# EAGLE design Monophase (EAGLE 9.4.2)
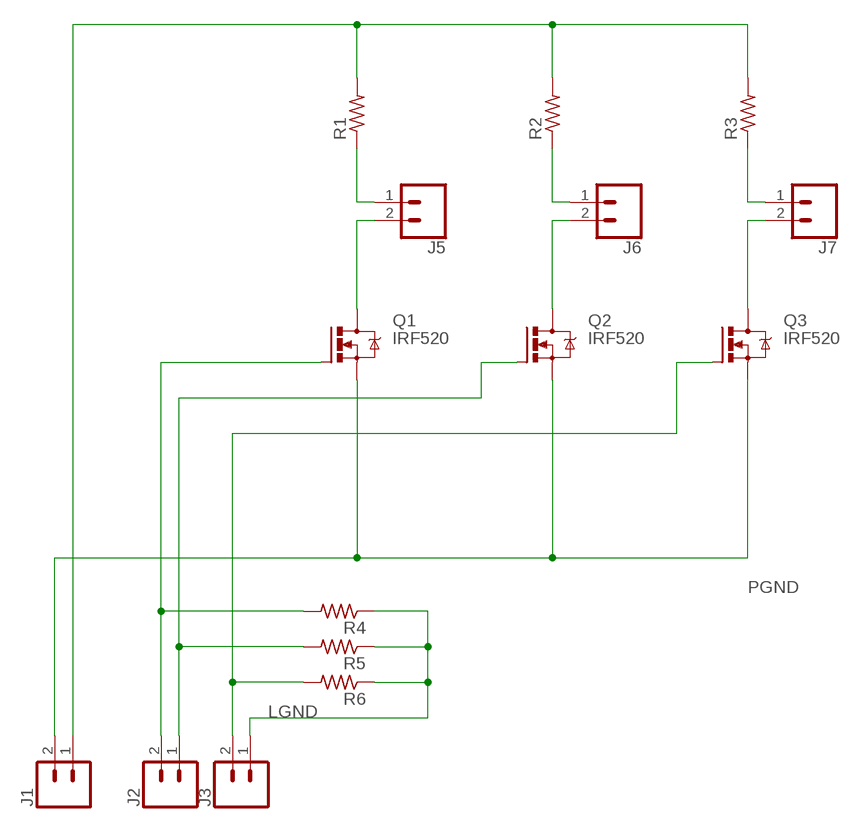
[diagram p0: schematic, sheet 1]

## Parts
J1  CONN_02POLAR_LOCK  [MOLEX-1X2_LOCK]
J2  CONN_02POLAR_LOCK  [MOLEX-1X2_LOCK]
J3  CONN_02POLAR_LOCK  [MOLEX-1X2_LOCK]
J5  CONN_02POLAR_LOCK  [MOLEX-1X2_LOCK]
J6  CONN_02POLAR_LOCK  [MOLEX-1X2_LOCK]
J7  CONN_02POLAR_LOCK  [MOLEX-1X2_LOCK]
Q1  IRF520  [TO220BV]
Q2  IRF520  [TO220BV]
Q3  IRF520  [TO220BV]
R1  R-US_0204/7  [0204/7]
R2  R-US_0204/7  [0204/7]
R3  R-US_0204/7  [0204/7]
R4  R-US_0204/7  [0204/7]
R5  R-US_0204/7  [0204/7]
R6  R-US_0204/7  [0204/7]

## Nets
LGND: J3.1 R4.1 R5.1 R6.1
N$1: J5.2 Q1.D
N$2: J6.2 Q2.D
N$3: J7.2 Q3.D
N$5: J5.1 R1.1
N$6: J6.1 R2.1
N$7: J7.1 R3.1
N$8: J1.1 R1.2 R2.2 R3.2
N$9: J2.2 Q1.G R4.2
N$10: J2.1 Q2.G R5.2
N$11: J3.2 Q3.G R6.2
PGND: J1.2 Q1.S Q2.S Q3.S

## Library data of the parts
J1-J3 J5-J7 = SparkFun-Connectors:CONN_02: Multi connection point. Often used as Generic Header-pin footprint for 0.1 inch spaced/style header connections On any of the 0.1 inch spaced packages, you can populate with these: Break Away Headers - Straight <https://www.sparkfun.com/products/116> (PRT-00116) Break Away Male Headers - Right Angle <https://www.sparkfun.com/products/553> (PRT-00553) Female Headers <https://www.sparkfun.com/products/115> (PRT-00115) Break Away Headers - Machine Pin <https://www.sparkfun.com/products/117> (PRT-00117) Break Away Female Headers - Swiss Machine Pin <https://www.sparkfun.com/products/743> (PRT-00743) For SCREWTERMINALS and SPRING TERMINALS visit here: Screw Terimnals on SparkFun.com <https://www.sparkfun.com/search/results?term=Screw+Terminals> (5mm/3.5mm/2.54mm spacing) This device is also useful as a general connection point to wire up your design to another part of your project. Our various solder wires solder well into these plated through hole pads. Hook-Up Wire - Assortment (Stranded, 22 AWG) <https://www.sparkfun.com/products/11375> (PRT-11375) Hook-Up Wire - Assortment (Solid Core, 22 AWG) <https://www.sparkfun.com/products/11367> (PRT-11367) View the entire wire category on our website here <https://www.sparkfun.com/categories/141> Special notes: Molex polarized connector foot print use with: PRT-08233 with associated crimp pins and housings. 2.54_SCREWTERM for use with PRT-10571. 3.5mm Screw Terminal footprints for PRT-08084 5mm Screw Terminal footprints for use with PRT-08432; SF_ID: PRT-09918
Q1-Q3 = transistor-power:IRF520: HEXFET Power MOSFET
R1-R6 = rcl:R-US_: RESISTOR, American symbol; SPICEPREFIX: R

## Board
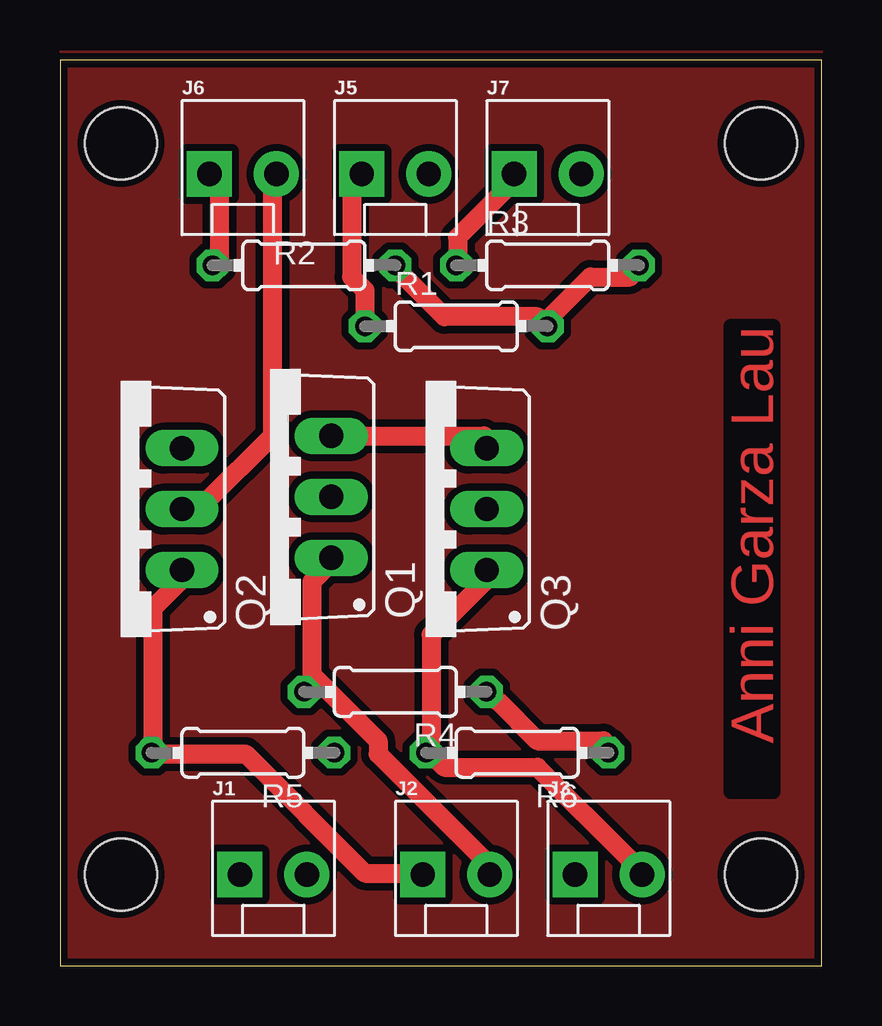
[diagram p1: board, top side]
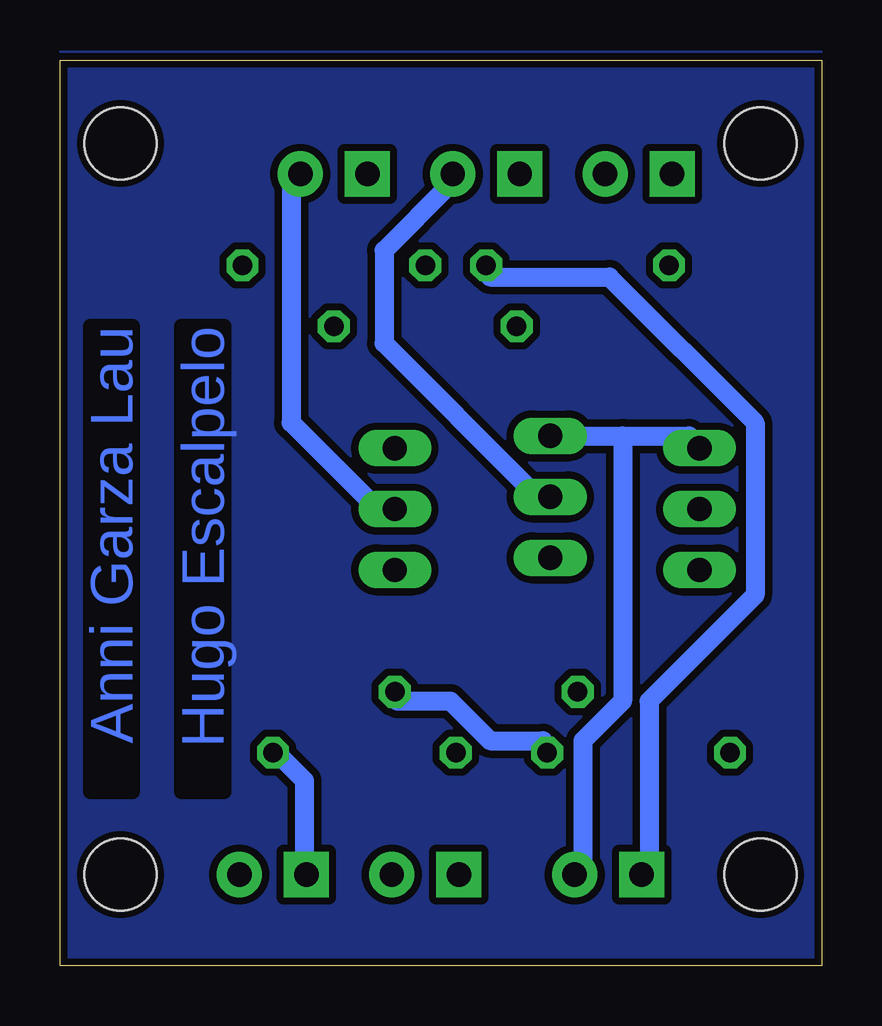
[diagram p2: board, bottom side, seen from below]

Size 31.73 x 37.77 mm. Coordinates in mm from the lower left corner, seen from the top.
Outline: 0,0 31.73,0 31.73,37.77 0,37.77 0,0
Copper layers (1*16): Top 0.035mm / dielectric 1.5mm / Bottom 0.035mm
Design rules "default *": minimum track width 0.8mm, minimum drill 0.35mm, track to track 12mil, track to pad 12mil, pad to pad 12mil, via to via 12mil, smd to smd 12mil, copper to edge 12mil, drill to drill 12mil, minimum pad ring 10mil, minimum via ring 8mil, stop-mask expansion 4mil, vias tented up to drill 0mil, thermal gap 10mil
Holes 3 mm at 2.54,3.81 29.21,3.81 2.54,34.29 29.21,34.29

### Footprints (pad centres in the part's own frame; a part is rotated, then mirrored left to right if it is on the bottom)
MOLEX-1X2_LOCK = drill 1.016 pad 1.88 square: 1 -0.127,0 | drill 1.016 pad 1.88: 2 2.667,0
TO220BV = drill 1.016 long: D 0,-2.54; G -2.54,-2.54; S 2.54,-2.54
0204/7 = drill 0.813 octagon: 1 -3.81,0; 2 3.81,0

### Placement (x,y rotation side)
J1  7.62,3.81 0 top
J2  15.24,3.81 0 top
J3  21.59,3.81 0 top
J5  12.7,33.02 0 top
J6  6.35,33.02 0 top
J7  19.05,33.02 0 top
Q1  8.76,19.56 90 top
Q2  2.54,19.05 90 top
Q3  15.24,19.05 90 top
R1  16.51,26.67 0 top
R2  10.16,29.21 0 top
R3  20.32,29.21 0 top
R4  13.97,11.43 180 top
R5  7.62,8.89 180 top
R6  19.05,8.89 180 top

### Tracks (layer width: path | path; a pad name or v marks a point on that pad's centre or on a via)
LGND
  Top 0.8: R6.1 22.65,9.39 19.89,9.39 18.23,11.05 R4.1
  Bottom 0.8: R5.1 11.6,9.39 13.81,9.39 15.47,11.05 17.68,11.05 R4.1 | J3.1 21.54,3.87 21.54,7.73 22.65,8.84 R6.1
N$1
  Bottom 0.8: Q1.D 11.6,19.89 12.15,19.89 18.23,25.96 18.23,29.83 15.47,32.59 J5.2
N$2
  Top 0.8: Q2.D 5.52,19.33 6.08,19.33 8.84,22.1 8.84,32.59 J6.2
N$3
  Bottom 0.8: Q3.D 18.23,19.33 18.78,19.33 22.1,22.65 22.1,32.59 J7.2
N$5
  Top 0.8: R1.1 12.71,27.07 12.71,28.17 12.15,28.73 12.15,32.59 J5.1
N$6
  Top 0.8: R2.1 6.63,29.28 6.63,32.59 J6.1
N$7
  Top 0.8: R3.1 16.57,29.28 16.57,30.38 18.78,32.59 J7.1
N$8
  Top 0.8: R2.2 14.36,28.73 16.02,27.07 19.89,27.07 R1.2 20.44,27.07 22.1,28.73 23.75,28.73 R3.2
  Bottom 0.8: J1.1 7.18,3.87 7.18,11.05 2.76,15.47 2.76,22.65 8.84,28.73 13.81,28.73 R2.2
N$9
  Top 0.8: 10.5,12.15 10.5,16.02 11.05,16.57 Q1.G | 10.5,12.15 10.5,11.6 R4.2 | 10.5,12.15 13.26,9.39 13.26,8.84 17.68,4.42 17.68,3.87 J2.2
N$10
  Top 0.8: Q2.G 4.97,16.02 3.87,14.91 3.87,9.39 R5.2 3.87,8.84 7.73,8.84 12.71,3.87 14.91,3.87 J2.1
N$11
  Top 0.8: Q3.G 17.68,16.02 15.47,13.81 15.47,9.39 R6.2 15.47,8.84 16.02,8.29 19.89,8.29 23.75,4.42 23.75,3.87 J3.2
PA
  pour Top (isolate 0.305, no thermals): 0,38.1 31.75,38.1 31.75,0 0,0
PB
  pour Bottom (isolate 0.305, no thermals): 0,0 31.75,0 31.75,38.1 0,38.1
PGND
  Top 0.8: Q3.S 17.68,22.1 11.6,22.1 Q1.S
  Bottom 0.8: 8.29,22.1 11.05,22.1 Q1.S | 8.29,22.1 5.52,22.1 Q2.S | 8.29,22.1 8.29,11.05 9.94,9.39 9.94,3.87 J1.2

### Text on the board
Top: Anni Garza Lau
Bottom: Hugo Escalpelo | Anni Garza Lau